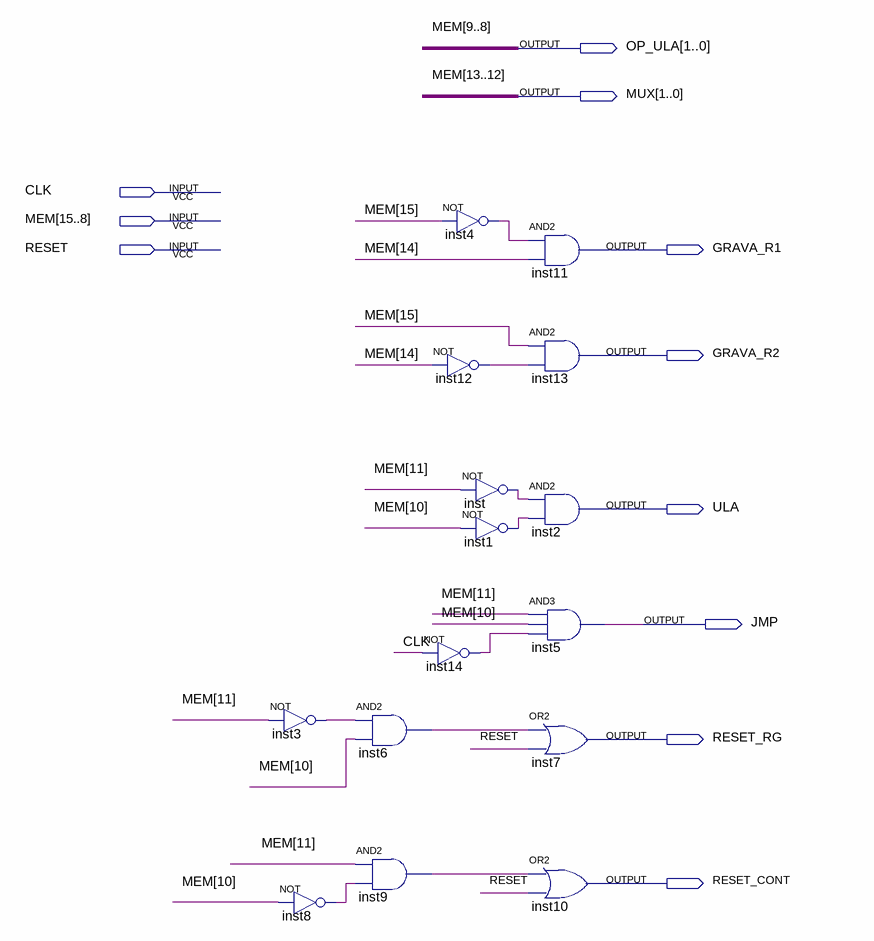
[diagram p0: schematic sheet]
// Quartus schematic UnidadeDeControle.bdf as structural Verilog: 15 symbols, 11 pins
module UnidadeDeControle (
  input  CLK,
  input  [15:8] MEM,
  input  RESET,
  output [1:0] OP_ULA,
  output [1:0] MUX,
  output GRAVA_R1,
  output GRAVA_R2,
  output ULA,
  output JMP,
  output RESET_RG,
  output RESET_CONT
);

  wire inst1_out, inst3_out, inst4_out, inst6_out, inst8_out, inst9_out, inst12_out, inst14_out, inst_out;

  not inst3 (inst3_out, MEM[11]);
  not inst8 (inst8_out, MEM[10]);
  not inst14 (inst14_out, CLK);
  and inst6 (inst6_out, inst3_out, MEM[10]);
  and inst9 (inst9_out, MEM[11], inst8_out);
  not inst4 (inst4_out, MEM[15]);
  not inst12 (inst12_out, MEM[14]);
  not inst (inst_out, MEM[11]);
  not inst1 (inst1_out, MEM[10]);
  and inst11 (GRAVA_R1, inst4_out, MEM[14]);
  and inst13 (GRAVA_R2, MEM[15], inst12_out);
  and inst2 (ULA, inst_out, inst1_out);
  and inst5 (JMP, MEM[11], MEM[10], inst14_out);
  or inst7 (RESET_RG, inst6_out, RESET);
  or inst10 (RESET_CONT, inst9_out, RESET);

  assign MUX = MEM[13:12];
  assign OP_ULA = MEM[9:8];
endmodule
